# EAGLE schematic Spannungsversorgung_V2 (EAGLE 9.6.2)
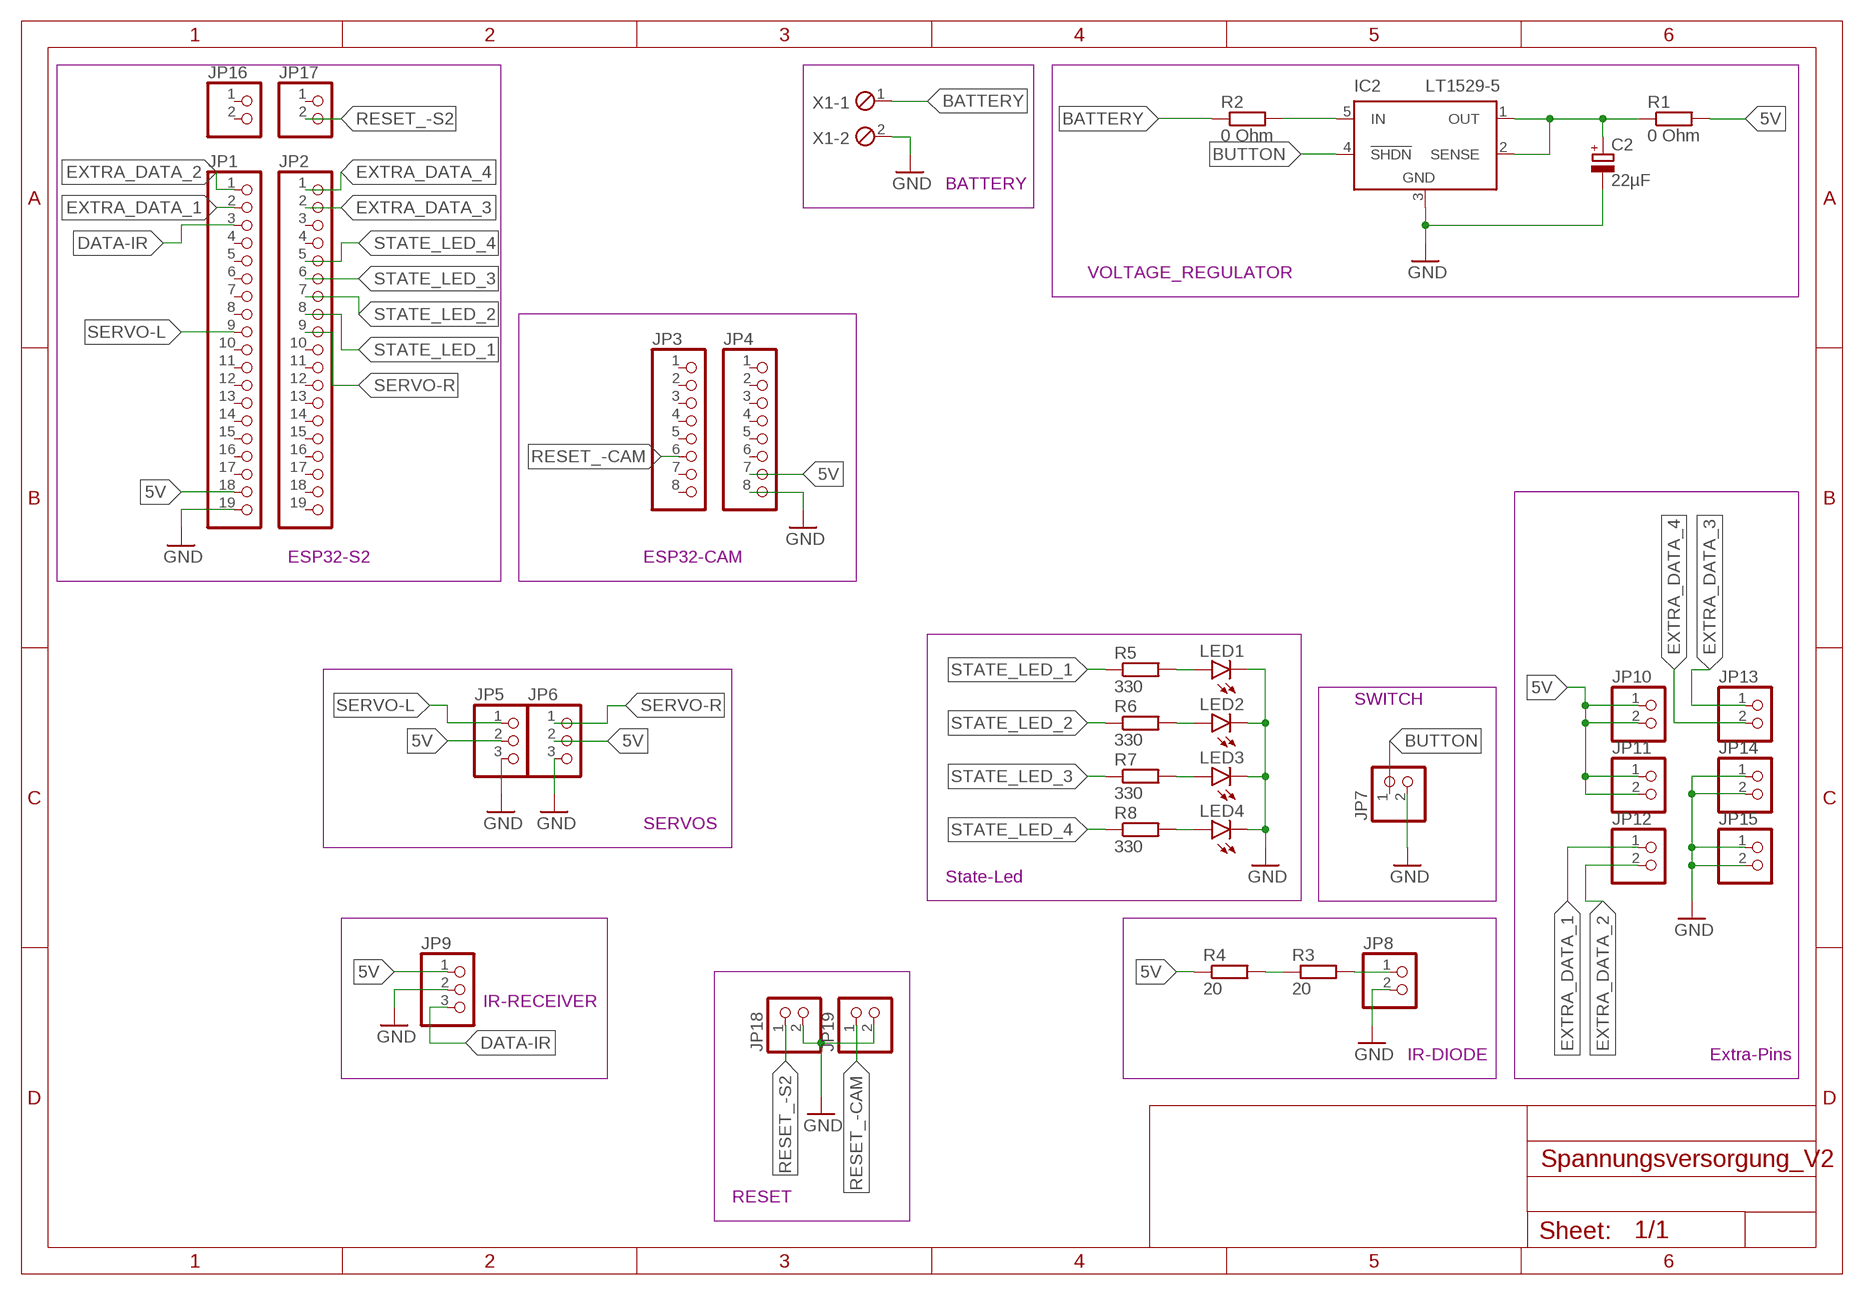
[diagram p0: schematic, sheet 1]

## Parts
C2  22µF  CPOL-EUE2.5-5  [E2,5-5]
IC2  LT1529-5  LT1529T  [TO220-5]
JP1  PINHD-1X19  [1X19]
JP2  PINHD-1X19  [1X19]
JP3  PINHD-1X8  [1X08]
JP4  PINHD-1X8  [1X08]
JP5  PINHD-1X3  [1X03]
JP6  PINHD-1X3  [1X03]
JP7  PINHD-1X2  [1X02]
JP8  PINHD-1X2  [1X02]
JP9  PINHD-1X3  [1X03]
JP10  PINHD-1X2  [1X02]
JP11  PINHD-1X2  [1X02]
JP12  PINHD-1X2  [1X02]
JP13  PINHD-1X2  [1X02]
JP14  PINHD-1X2  [1X02]
JP15  PINHD-1X2  [1X02]
JP16  PINHD-1X2  [1X02]
JP17  PINHD-1X2  [1X02]
JP18  PINHD-1X2  [1X02]
JP19  PINHD-1X2  [1X02]
LED1  LED3MM  [LED3MM]
LED2  LED3MM  [LED3MM]
LED3  LED3MM  [LED3MM]
LED4  LED3MM  [LED3MM]
R1  0 Ohm  R-EU_R0805  [R0805]
R2  0 Ohm  R-EU_R0805  [R0805]
R3  20  R-EU_0309/12  [0309/12]
R4  20  R-EU_0309/12  [0309/12]
R5  330  R-EU_R0805  [R0805]
R6  330  R-EU_R0805  [R0805]
R7  330  R-EU_R0805  [R0805]
R8  330  R-EU_R0805  [R0805]
X1  MPT2  [2POL254]

## Nets
5V: JP1.18 JP4.7 JP5.2 JP6.2 JP9.1 JP10.1 JP10.2 JP11.1 JP11.2 R1.2 R4.1
BATTERY: R2.1 X1.1
BUTTON: IC2.4(!SHDN) JP7.1
DATA-IR: JP1.3 JP9.3
EXTRA_DATA_1: JP1.2 JP12.1
EXTRA_DATA_2: JP1.1 JP12.2
EXTRA_DATA_3: JP2.2 JP13.1
EXTRA_DATA_4: JP2.1 JP13.2
GND: C2.- IC2.3(GND) JP1.19 JP4.8 JP5.3 JP6.3 JP7.2 JP8.2 JP9.2 JP14.1 JP14.2 JP15.1 JP15.2 JP18.2 JP19.2 LED1.K(C) LED2.K(C) LED3.K(C) LED4.K(C) X1.2
N$1: R3.1 R4.2
N$2: JP8.1 R3.2
N$3: IC2.5(IN) R2.2
N$4: C2.+ IC2.1(OUT) IC2.2(SENSE) R1.1
N$5: LED1.A R5.2
N$6: LED2.A R6.2
N$7: LED3.A R7.2
N$8: LED4.A R8.2
RESET_-CAM: JP3.6 JP19.1
RESET_-S2: JP17.2 JP18.1
SERVO-L: JP1.9 JP5.1
SERVO-R: JP2.9 JP6.1
STATE_LED_1: JP2.8 R5.1
STATE_LED_2: JP2.7 R6.1
STATE_LED_3: JP2.6 R7.1
STATE_LED_4: JP2.5 R8.1
Unconnected: JP1.4 JP1.5 JP1.6 JP1.7 JP1.8 JP1.10 JP1.11 JP1.12 JP1.13 JP1.14 JP1.15 JP1.16 JP1.17 JP2.3 JP2.4 JP2.10 JP2.11 JP2.12 JP2.13 JP2.14 JP2.15 JP2.16 JP2.17 JP2.18 JP2.19 JP3.1 JP3.2 JP3.3 JP3.4 JP3.5 JP3.7 JP3.8 JP4.1 JP4.2 JP4.3 JP4.4 JP4.5 JP4.6 JP16.1 JP16.2 JP17.1

## Notes on the sheet
- BATTERY
- VOLTAGE_REGULATOR
- ESP32-S2 | ESP32-CAM
- SWITCH
- SERVOS
- State-Led
- IR-RECEIVER
- IR-DIODE | Extra-Pins
- RESET

## Library data of the parts
C2 = rcl:CPOL-EU: POLARIZED CAPACITOR, European symbol; SPICEPREFIX: C
IC2 = ltc1440_lt1529_ds1302:LT1529: LT1529 5 Volt LDO Regulator 5 Volt, 3 Ampere Low Dropout voltage regulator.
JP1 JP2 = pinhead:PINHD-1X19: PIN HEADER
JP3 JP4 = pinhead:PINHD-1X8: PIN HEADER
JP5 JP6 JP9 = pinhead:PINHD-1X3: PIN HEADER
JP7 JP8 JP10-JP19 = pinhead:PINHD-1X2: PIN HEADER
LED1-LED4 = led:LED: LED OSRAM: - CHIPLED LG R971, LG N971, LY N971, LG Q971, LY Q971, LO R971, LY R971 LH N974, LH R974 LS Q976, LO Q976, LY Q976 LO Q996 - Hyper CHIPLED LW Q18S LB Q993, LB Q99A, LB R99A - SideLED LS A670, LO A670, LY A670, LG A670, LP A670 LB A673, LV A673, LT A673, LW A673 LH A674 LY A675 LS A676, LA A676, LO A676, LY A676, LW A676 LS A679, LY A679, LG A679 - Hyper Micro SIDELED® LS Y876, LA Y876, LO Y876, LY Y876 LT Y87S - SmartLED LW L88C, LW L88S LB L89C, LB L89S, LG L890 LS L89K, LO L89K, LY L89K LS L896, LA L896, LO L896, LY L896 - TOPLED LS T670, LO T670, LY T670, LG T670, LP T670 LSG T670, LSP T670, LSY T670, LOP T670, LYG T670 LG T671, LOG T671, LSG T671 LB T673, LV T673, LT T673, LW T673 LH T674 LS T676, LA T676, LO T676, LY T676, LB T676, LH T676, LSB T676, LW T676 LB T67C, LV T67C, LT T67C, LS T67K, LO T67K, LY T67K, LW E67C LS E67B, LA E67B, LO E67B, LY E67B, LB E67C, LV E67C, LT E67C LW T67C LS T679, LY T679, LG T679 LS T770, LO T770, LY T770, LG T770, LP T770 LB T773, LV T773, LT T773, LW T773 LH T774 LS E675, LA E675, LY E675, LS T675 LS T776, LA T776, LO T776, LY T776, LB T776 LHGB T686 LT T68C, LB T68C - Hyper Mini TOPLED® LB M676 - Mini TOPLED Santana® LG M470 LS M47K, LO M47K, LY M47K Source: http://www.osram.convergy.de LUXEON: - LUMILED® LXK2-PW12-R00, LXK2-PW12-S00, LXK2-PW14-U00, LXK2-PW14-V00 LXK2-PM12-R00, LXK2-PM12-S00, LXK2-PM14-U00 LXK2-PE12-Q00, LXK2-PE12-R00, LXK2-PE12-S00, LXK2-PE14-T00, LXK2-PE14-U00 LXK2-PB12-K00, LXK2-PB12-L00, LXK2-PB12-M00, LXK2-PB14-N00, LXK2-PB14-P00, LXK2-PB14-Q00 LXK2-PR12-L00, LXK2-PR12-M00, LXK2-PR14-Q00, LXK2-PR14-R00 LXK2-PD12-Q00, LXK2-PD12-R00, LXK2-PD12-S00 LXK2-PH12-R00, LXK2-PH12-S00 LXK2-PL12-P00, LXK2-PL12-Q00, LXK2-PL12-R00 Source: www.luxeon.com KINGBRIGHT: KA-3528ASYC Source: www.kingbright.com
R1-R8 = rcl:R-EU_: RESISTOR, European symbol; SPICEPREFIX: R
X1 = con-phoenix-254:MPT2: PHOENIX CONNECTOR; OC_FARNELL: unknown; OC_NEWARK: unknown